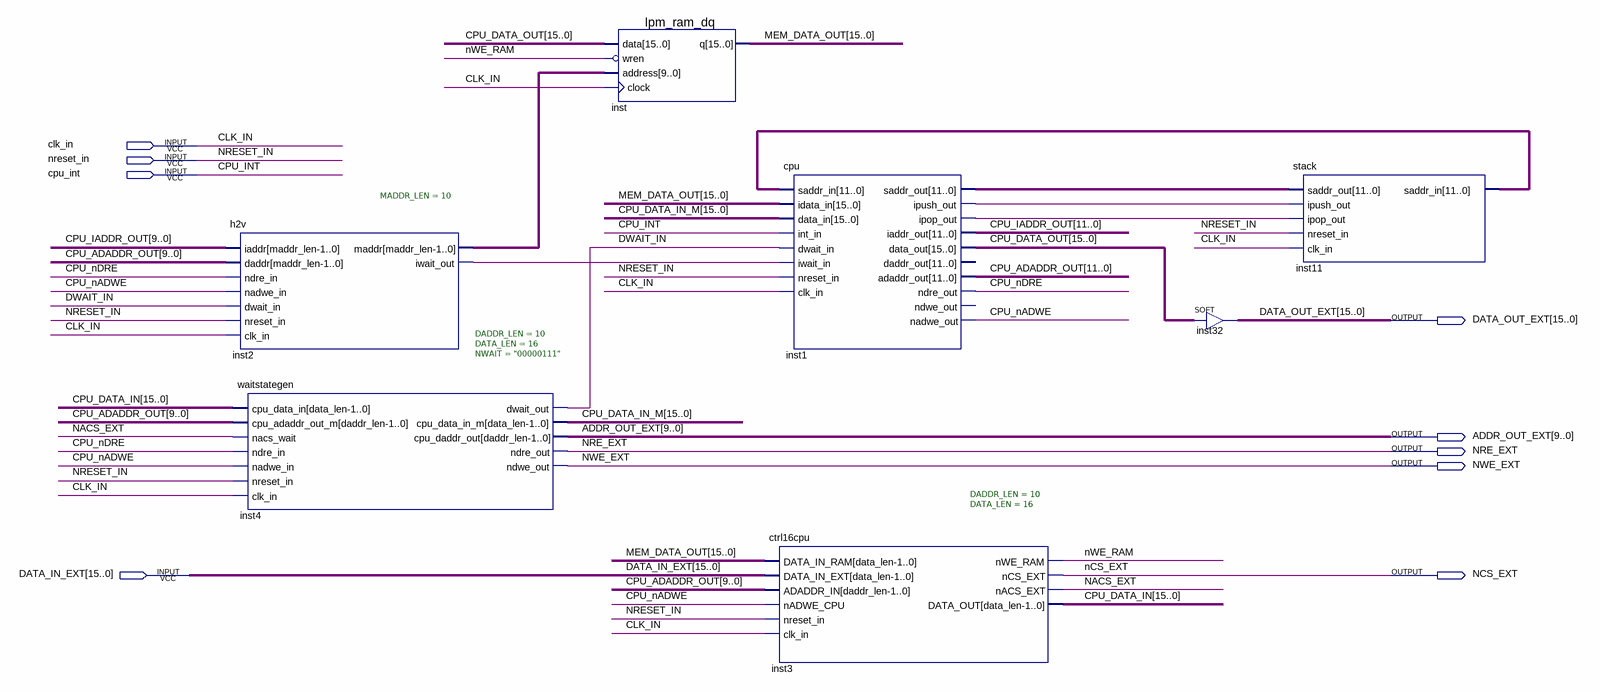
[diagram p0: schematic sheet]
// Quartus schematic cpu16bit.bdf as structural Verilog: 7 symbols, 9 pins
module cpu16bit (
  input  clk_in,
  input  nreset_in,
  input  cpu_int,
  input  [15:0] DATA_IN_EXT,
  output [15:0] DATA_OUT_EXT,
  output [9:0] ADDR_OUT_EXT,
  output NRE_EXT,
  output NWE_EXT,
  output NCS_EXT
);

  wire CPU_nADWE, CPU_nDRE, DWAIT_IN, inst1_ipop_out, inst1_ipush_out, inst2_iwait_out, NACS_EXT, nWE_RAM;
  wire [9:0] inst2_maddr;
  wire [11:0] CPU_ADADDR_OUT, CPU_IADDR_OUT, inst1_saddr_out, inst11_saddr_in;
  wire [15:0] CPU_DATA_IN, CPU_DATA_IN_M, CPU_DATA_OUT, MEM_DATA_OUT;

  h2v #(.MADDR_LEN(10)) inst2 (
    .iaddr(CPU_IADDR_OUT[9:0]), .daddr(CPU_ADADDR_OUT[9:0]), .ndre_in(CPU_nDRE), .nadwe_in(CPU_nADWE),
    .dwait_in(DWAIT_IN), .nreset_in(nreset_in), .clk_in(clk_in), .maddr(inst2_maddr),
    .iwait_out(inst2_iwait_out));
  waitstategen #(.DADDR_LEN(10), .DATA_LEN(16), .NWAIT("00000111")) inst4 (
    .cpu_data_in(CPU_DATA_IN), .cpu_adaddr_out_m(CPU_ADADDR_OUT[9:0]), .nacs_wait(NACS_EXT),
    .ndre_in(CPU_nDRE), .nadwe_in(CPU_nADWE), .nreset_in(nreset_in), .clk_in(clk_in), .dwait_out(DWAIT_IN),
    .cpu_data_in_m(CPU_DATA_IN_M), .cpu_daddr_out(ADDR_OUT_EXT), .ndre_out(NRE_EXT), .ndwe_out(NWE_EXT));
  lpm_ram_dq inst (.data(CPU_DATA_OUT), .wren(~nWE_RAM), .address(inst2_maddr), .clock(clk_in), .q(MEM_DATA_OUT));
  cpu inst1 (
    .saddr_in(inst11_saddr_in), .idata_in(MEM_DATA_OUT), .data_in(CPU_DATA_IN_M), .int_in(cpu_int),
    .dwait_in(DWAIT_IN), .iwait_in(inst2_iwait_out), .nreset_in(nreset_in), .clk_in(clk_in),
    .saddr_out(inst1_saddr_out), .ipush_out(inst1_ipush_out), .ipop_out(inst1_ipop_out),
    .iaddr_out(CPU_IADDR_OUT), .data_out(CPU_DATA_OUT), .adaddr_out(CPU_ADADDR_OUT), .ndre_out(CPU_nDRE),
    .nadwe_out(CPU_nADWE));  // open: daddr_out, ndwe_out
  ctrl16cpu #(.DADDR_LEN(10), .DATA_LEN(16)) inst3 (
    .DATA_IN_RAM(MEM_DATA_OUT), .DATA_IN_EXT(DATA_IN_EXT), .ADADDR_IN(CPU_ADADDR_OUT[9:0]),
    .nADWE_CPU(CPU_nADWE), .nreset_in(nreset_in), .clk_in(clk_in), .nWE_RAM(nWE_RAM), .nCS_EXT(NCS_EXT),
    .nACS_EXT(NACS_EXT), .DATA_OUT(CPU_DATA_IN));
  SOFT inst32[15:0] (.IN(CPU_DATA_OUT), .OUT(DATA_OUT_EXT));
  stack inst11 (
    .saddr_out(inst1_saddr_out), .ipush_out(inst1_ipush_out), .ipop_out(inst1_ipop_out),
    .nreset_in(nreset_in), .clk_in(clk_in), .saddr_in(inst11_saddr_in));
endmodule
